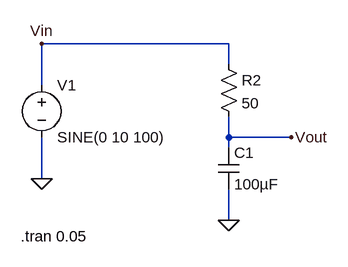
[diagram p0: schematic lab02-Capacitor-sine.asc]
lab02-Capacitor-sine.asc, the LTspice schematic file:
Version 4
SHEET 1 880 680
WIRE 304 32 16 32
WIRE 304 64 304 32
WIRE 16 96 16 32
WIRE 304 176 304 144
WIRE 400 176 304 176
WIRE 304 192 304 176
WIRE 16 240 16 176
WIRE 304 304 304 256
FLAG 16 240 0
FLAG 304 304 0
FLAG 16 32 Vin
FLAG 400 176 Vout
SYMBOL res 288 48 R0
SYMATTR InstName R2
SYMATTR Value 50
SYMATTR SpiceLine pwr=0.5
SYMBOL voltage 16 80 R0
WINDOW 123 0 0 Left 0
WINDOW 39 0 0 Left 0
SYMATTR InstName V1
SYMATTR Value SINE(0 10 100)
SYMBOL cap 288 192 R0
SYMATTR InstName C1
SYMATTR Value 100µF
SYMATTR SpiceLine V=100
TEXT -16 328 Left 0 !.tran 0.05

The netlist it stands for:
* lab02-Capacitor-sine.asc
R2 Vin Vout 50 pwr=0.5
V1 Vin 0 SINE(0 10 100)
C1 Vout 0 100µF V=100
.tran 0.05
.backanno
.end